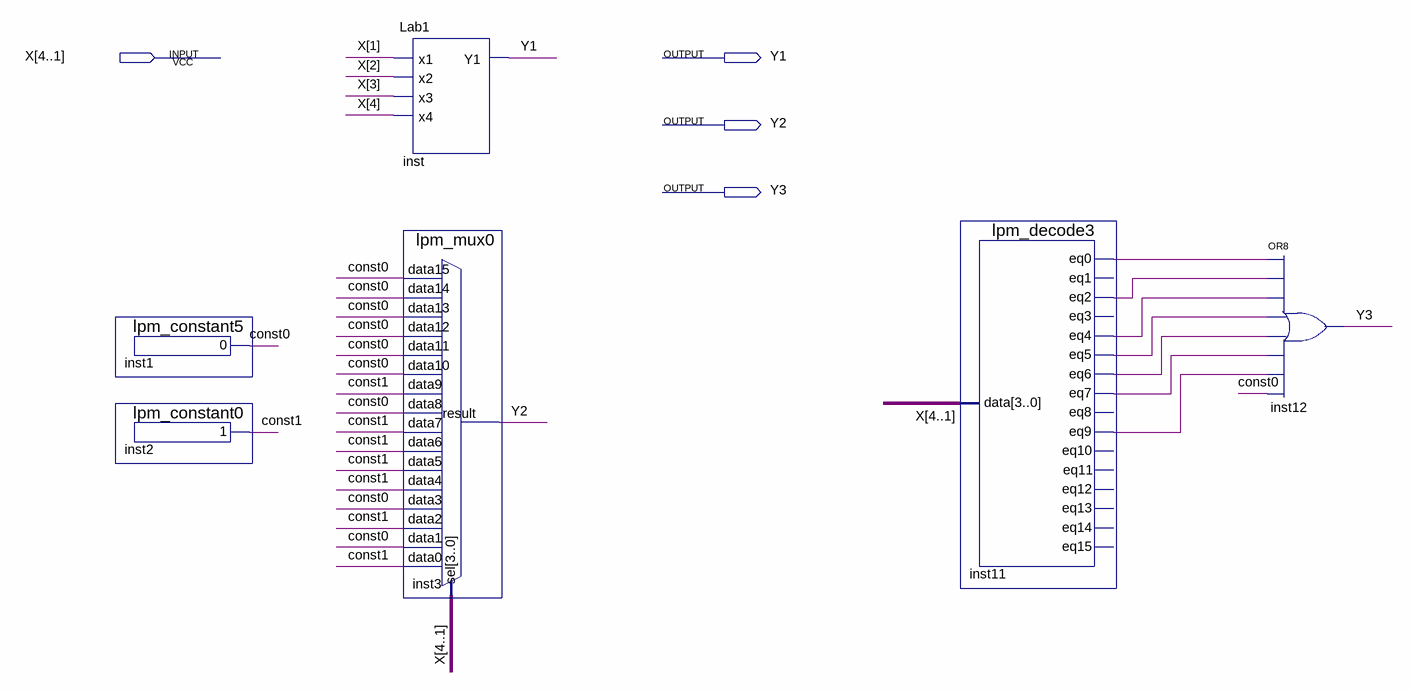
[diagram p0: schematic sheet]
// Quartus schematic Lab2.bdf as structural Verilog: 6 symbols, 4 pins
module Lab2 (
  input  [4:1] X,
  output Y1,
  output Y2,
  output Y3
);

  wire const0, const1, inst11_eq0, inst11_eq2, inst11_eq4, inst11_eq5, inst11_eq6, inst11_eq7, inst11_eq9;

  lpm_constant5 inst1 (.result(const0));
  lpm_constant0 inst2 (.result(const1));
  Lab1 inst (.x1(X[1]), .x2(X[2]), .x3(X[3]), .x4(X[4]), .Y1(Y1));
  lpm_mux0 inst3 (
    .data15(const0), .data14(const0), .data13(const0), .data12(const0), .data11(const0), .data10(const0),
    .data9(const1), .data8(const0), .data7(const1), .data6(const1), .data5(const1), .data4(const1),
    .data3(const0), .data2(const1), .data1(const0), .data0(const1), .sel(X), .result(Y2));
  lpm_decode3 inst11 (
    .data(X), .eq0(inst11_eq0), .eq2(inst11_eq2), .eq4(inst11_eq4), .eq5(inst11_eq5), .eq6(inst11_eq6),
    .eq7(inst11_eq7), .eq9(inst11_eq9));  // open: eq1, eq3, eq8, eq10, eq11, eq12, eq13, eq14, eq15
  or inst12 (Y3, inst11_eq0, inst11_eq2, inst11_eq4, inst11_eq5, inst11_eq6, inst11_eq7, inst11_eq9, const0);
endmodule
